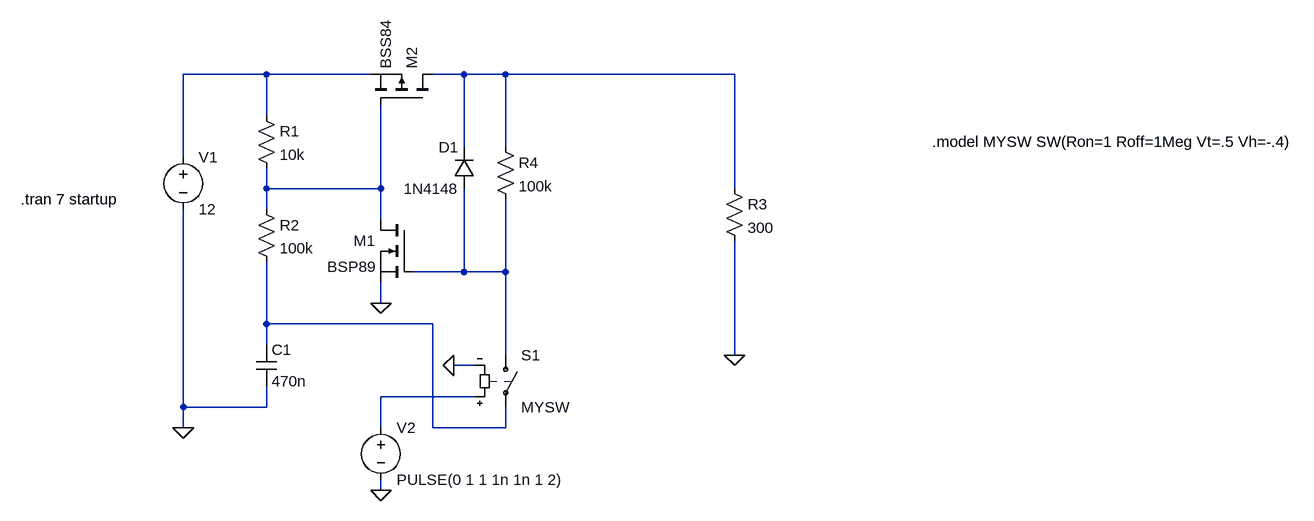
[diagram p0: schematic toggle_circuit.asc]
toggle_circuit.asc, the LTspice schematic file:
Version 4
SHEET 1 1452 724
WIRE -176 0 -304 0
WIRE -16 0 -176 0
WIRE 128 0 80 0
WIRE 192 0 128 0
WIRE 544 0 192 0
WIRE -176 64 -176 0
WIRE 128 112 128 0
WIRE 192 112 192 0
WIRE -304 128 -304 0
WIRE -176 176 -176 144
WIRE 0 176 0 48
WIRE 0 176 -176 176
WIRE 544 176 544 0
WIRE -176 208 -176 176
WIRE 0 224 0 176
WIRE 128 304 128 176
WIRE 128 304 48 304
WIRE 192 304 192 192
WIRE 192 304 128 304
WIRE 0 352 0 320
WIRE -176 384 -176 288
WIRE 80 384 -176 384
WIRE -176 416 -176 384
WIRE 192 432 192 304
WIRE 544 432 544 256
WIRE 144 448 112 448
WIRE 144 496 0 496
WIRE -304 512 -304 208
WIRE -176 512 -176 480
WIRE -176 512 -304 512
WIRE -304 544 -304 512
WIRE 0 544 0 496
WIRE 80 544 80 384
WIRE 192 544 192 512
WIRE 192 544 80 544
WIRE 0 640 0 624
FLAG -304 544 0
FLAG 544 432 0
FLAG 112 448 0
FLAG 0 640 0
FLAG 0 352 0
SYMBOL nmos 48 224 M0
SYMATTR InstName M1
SYMATTR Value BSP89
SYMBOL pmos 80 48 M270
SYMATTR InstName M2
SYMATTR Value BSS84
SYMBOL voltage -304 112 R0
WINDOW 123 0 0 Left 0
WINDOW 39 0 0 Left 0
SYMATTR InstName V1
SYMATTR Value 12
SYMBOL res -192 48 R0
SYMATTR InstName R1
SYMATTR Value 10k
SYMBOL res -192 192 R0
SYMATTR InstName R2
SYMATTR Value 100k
SYMBOL cap -192 416 R0
SYMATTR InstName C1
SYMATTR Value 470n
SYMBOL res 528 160 R0
SYMATTR InstName R3
SYMATTR Value 300
SYMBOL res 176 96 R0
SYMATTR InstName R4
SYMATTR Value 100k
SYMBOL sw 192 416 R0
SYMATTR InstName S1
SYMATTR Value MYSW
SYMBOL voltage 0 528 R0
WINDOW 123 0 0 Left 0
WINDOW 39 0 0 Left 0
SYMATTR InstName V2
SYMATTR Value PULSE(0 1 1 1n 1n 1 2)
SYMBOL diode 144 176 R180
WINDOW 0 24 64 Left 2
WINDOW 3 24 0 Left 2
SYMATTR InstName D1
SYMATTR Value 1N4148
TEXT -554 192 Left 2 !.tran 7 startup
TEXT 848 104 Left 2 !.model MYSW SW(Ron=1 Roff=1Meg Vt=.5 Vh=-.4)

The netlist it stands for:
* toggle_circuit.asc
M1 N003 N004 0 0 BSP89
M2 N002 N003 N001 N001 BSS84
V1 N001 0 12
R1 N001 N003 10k
R2 N003 N005 100k
C1 N005 0 470n
R3 N002 0 300
R4 N002 N004 100k
S1 N004 N005 N006 0 MYSW
V2 N006 0 PULSE(0 1 1 1n 1n 1 2)
D1 N004 N002 1N4148
.model D D
.lib standard.dio
.model NMOS NMOS
.model PMOS PMOS
.lib standard.mos
.tran 7 startup
.model MYSW SW(Ron=1 Roff=1Meg Vt=.5 Vh=-.4)
.backanno
.end